# EAGLE design ArduSensor Shield-v13 (EAGLE 6.5.0)
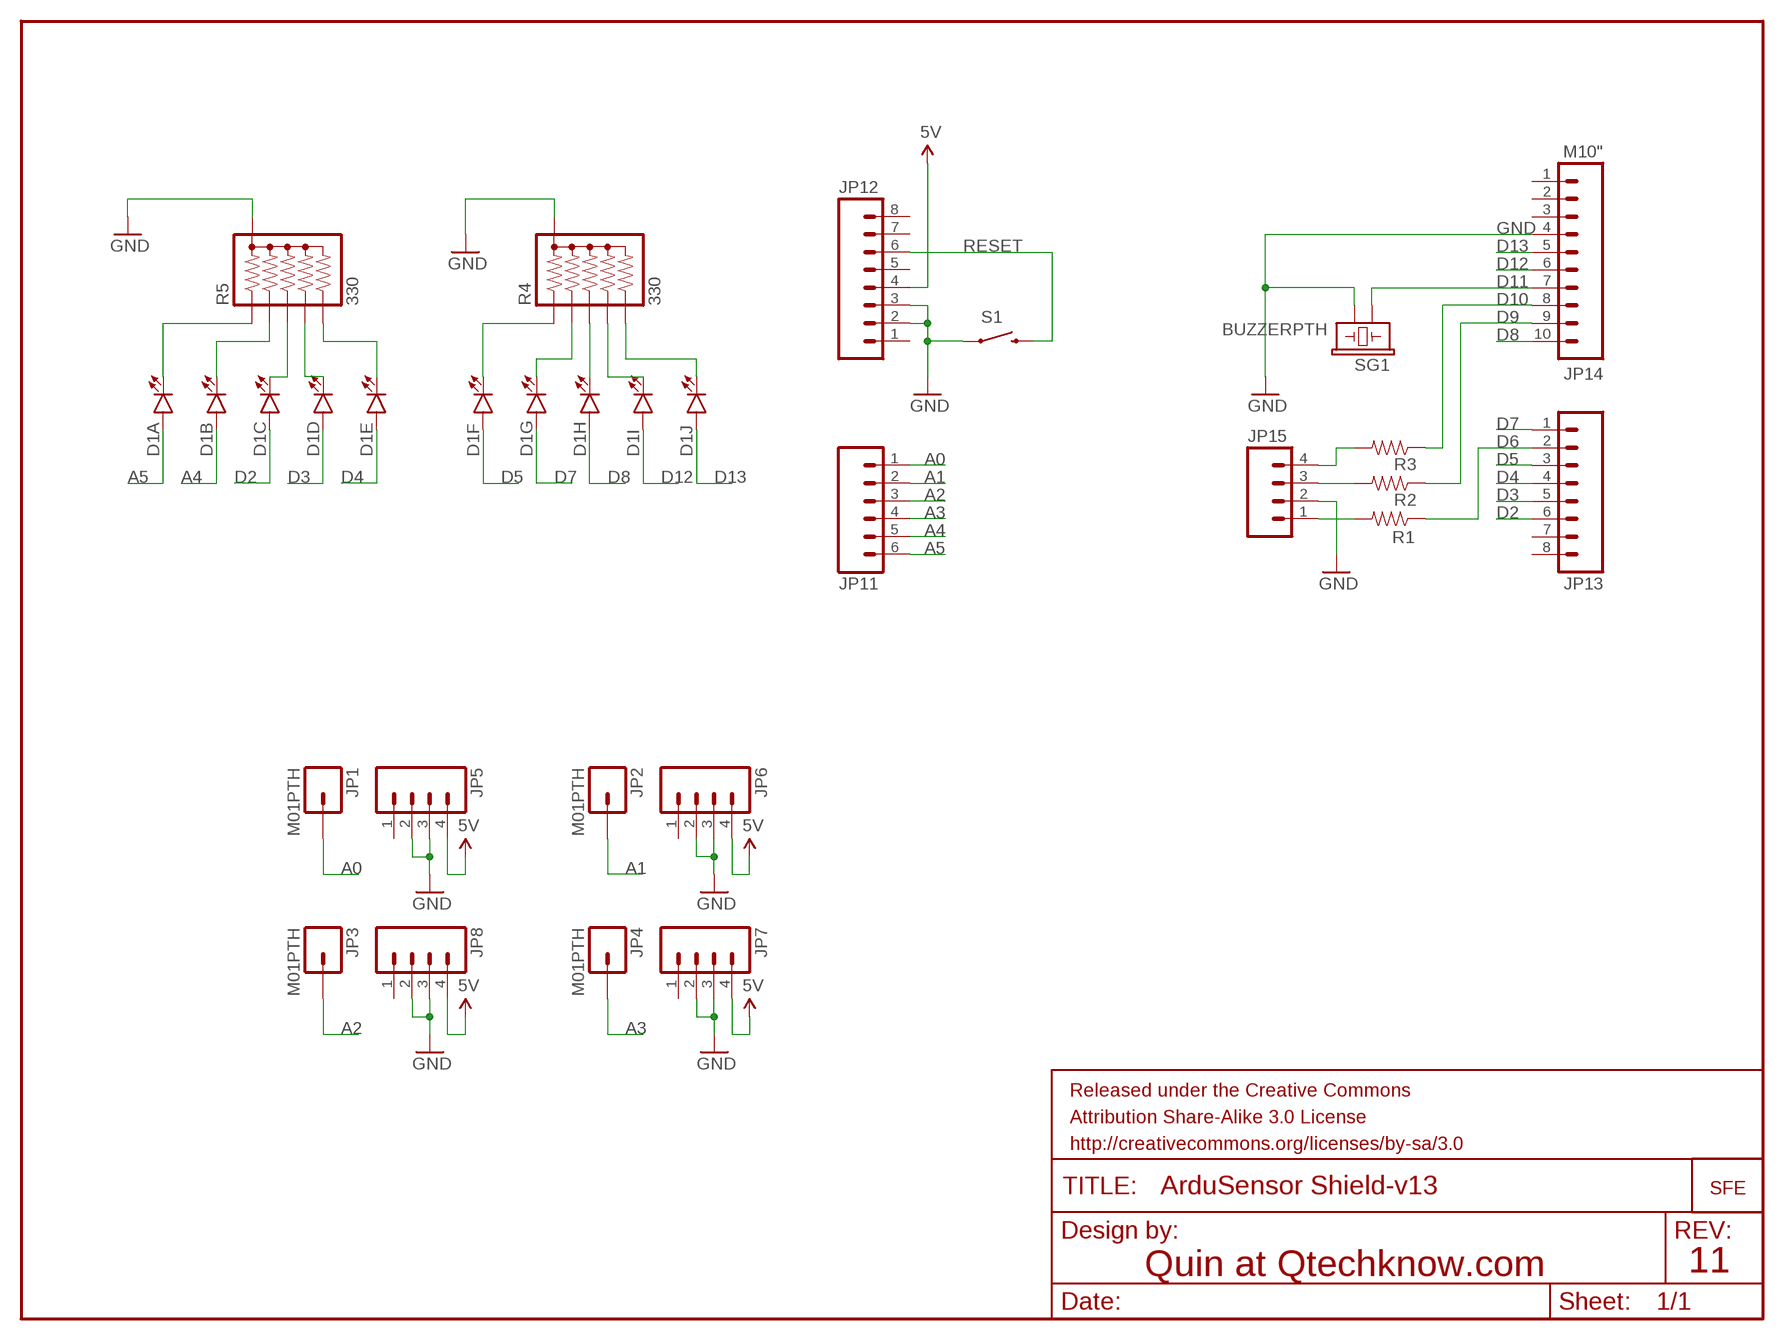
[diagram p0: schematic, sheet 1]

## Parts
D1  LED_BARGRAPH_10  [LED_BARGAPH_10]
FRAME1  FRAME-LETTER  [CREATIVE_COMMONS]
JP1  M01PTH  [1X01]
JP2  M01PTH  [1X01]
JP3  M01PTH  [1X01]
JP4  M01PTH  [1X01]
JP5  M04PTH  [1X04]
JP6  M04PTH  [1X04]
JP7  M04PTH  [1X04]
JP8  M04PTH  [1X04]
JP9  LOGO-SFENEW  [SFE-NEW-WEBLOGO]
JP11  M06SIP  [1X06]
JP12  M081X08  [1X08]
JP13  M081X08  [1X08]
JP14  M10"  [1X10]
JP15  M04PTH  [1X04]
R1  RESISTORPTH-1/6W  [1/6W-RES]
R2  RESISTORPTH-1/6W  [1/6W-RES]
R3  RESISTORPTH-1/6W  [1/6W-RES]
R4  330  RPACK-BUSSED-SIP-PTH-5  [RPACK-SIP-PTH-5]
R5  330  RPACK-BUSSED-SIP-PTH-5  [RPACK-SIP-PTH-5]
S1  SWITCH-MOMENTARY-2PTH  [TACTILE-PTH]
SG1  BUZZERPTH  [BUZZER-12MM]

## Nets
5V: JP5.4 JP6.4 JP7.4 JP8.4 JP12.4
A0: JP1.1 JP11.1
A1: JP2.1 JP11.2
A2: JP3.1 JP11.3
A3: JP4.1 JP11.4
A4: D1.2(B:A) JP11.5
A5: D1.1(A:A) JP11.6
D2: D1.3(C:A) JP13.6
D3: D1.4(D:A) JP13.5
D4: D1.5(E:A) JP13.4
D5: D1.6(F:A) JP13.3
D6: JP13.2 R1.1
D7: D1.7(G:A) JP13.1
D8: D1.8(H:A) JP14.10
D9: JP14.9 R2.1
D10: JP14.8 R3.1
D11: JP14.7 SG1.+
D12: D1.9(I:A) JP14.6
D13: D1.10(J:A) JP14.5
GND: JP5.2 JP5.3 JP6.2 JP6.3 JP7.2 JP7.3 JP8.2 JP8.3 JP12.2 JP12.3 JP14.4 JP15.2 R4.P$1 R5.P$1 S1.1 SG1.-
N$1: JP15.1 R1.2
N$2: JP15.3 R2.2
N$3: JP15.4 R3.2
N$17: D1.11(J:C) R4.P$6
N$18: D1.12(I:C) R4.P$5
N$19: D1.13(H:C) R4.P$4
N$20: D1.14(G:C) R4.P$3
N$21: D1.15(F:C) R4.P$2
N$23: D1.16(E:C) R5.P$6
N$24: D1.17(D:C) R5.P$5
N$25: D1.18(C:C) R5.P$4
N$26: D1.19(B:C) R5.P$3
N$27: D1.20(A:C) R5.P$2
RESET: JP12.6 S1.3
Unconnected: JP5.1 JP6.1 JP7.1 JP8.1 JP12.1 JP12.5 JP12.7 JP12.8 JP13.7 JP13.8 JP14.1 JP14.2 JP14.3

## Notes on the sheet
- Quin at Qtechknow.com | 11

## Library data of the parts
D1 = SFE LED:LED_BARGRAPH_10: 10-Segment LED Bar Graph SFE part numbers: COM-09935 (red, Vf = 2.1V, Ifmax = 20mA) COM-09936 (yellow, Vf = 2.1V, Ifmax = 20mA) COM-09937 (blue, Vf = 3.4V, Ifmax = 20mA) COM-09938 (green, Vf = 3.4V, Ifmax = 20mA)
FRAME1 = SparkFun-Aesthetics:FRAME-LETTER: Schematic Frame Standard 8.5x11 US Letter frame
JP1-JP4 = SFE Connectors:M01: Header 1 Standard 1-pin 0.1" header. Use with straight break away headers (SKU : PRT-00116), right angle break away headers (PRT-00553), swiss pins (PRT-00743), machine pins (PRT-00117), and female headers (PRT-00115).
JP5-JP8 JP15 = SFE Connectors:M04: Header 4 Standard 4-pin 0.1" header. Use with straight break away headers (SKU : PRT-00116), right angle break away headers (PRT-00553), swiss pins (PRT-00743), machine pins (PRT-00117), and female headers (PRT-00115). Molex polarized connector foot print use with SKU : PRT-08231 with associated crimp pins and housings. 1MM SMD Version SKU: PRT-10208
JP9 = SparkFun-Aesthetics:LOGO-SFE: Spark Fun Electronics PCB Logo This is the standard Spark Fun Electronics PCB logo.
JP11 = SFE Connectors:M06: Header 6 Standard 6-pin 0.1" header. Use with straight break away headers (SKU : PRT-00116), right angle break away headers (PRT-00553), swiss pins (PRT-00743), machine pins (PRT-00117), and female headers (PRT-00115). Molex polarized connector foot print use with SKU : PRT-08094 with associated crimp pins and housings. NOTES ON THE VARIANTS LOCK and LOCK_LONGPADS... This footprint was designed to help hold the alignment of a through-hole component (i.e. 6-pin header) while soldering it into place. You may notice that each hole has been shifted either up or down by 0.005 of an inch from it's more standard position (which is a perfectly straight line). This slight alteration caused the pins (the squares in the middle) to touch the edges of the holes. Because they are alternating, it causes a "brace" to hold the component in place. 0.005 has proven to be the perfect amount of "off-center" position when using our standard breakaway headers. Although looks a little odd when you look at the bare footprint, once you have a header in there, the alteration is very hard to notice. Also, if you push a header all the way into place, it is covered up entirely on the bottom side. This idea of altering the position of holes to aid alignment will be further integrated into the Sparkfun Library for other footprints. It can help hold any component with 3 or more connection pins.
JP12 JP13 = SFE Connectors:M08: Header 8 Standard 8-pin 0.1" header. Use with straight break away headers (SKU : PRT-00116), right angle break away headers (PRT-00553), swiss pins (PRT-00743), machine pins (PRT-00117), and female headers (PRT-00115).
JP14 = SFE Connectors:M10: Header 10 Standard 10-pin 0.1" header. Use with straight break away headers (SKU : PRT-00116), right angle break away headers (PRT-00553), swiss pins (PRT-00743), machine pins (PRT-00117), and female headers (PRT-00115).
R1-R3 = SparkFun-Resistors:RESISTOR: Resistor Basic schematic elements and footprints for 0603, 1206, and PTH resistors.
R4 R5 = SparkFun-Resistors:RPACK: BOURNS 4600X series thick-film SIP resistor packs Five resistors bussed to a single pin (denoted by dot). 0.2W / resistor datasheet <http://dlnmh9ip6v2uc.cloudfront.net/datasheets/Components/General/4600x.pdf> SFE parts COM-10855 (330), COM-10856 (10K)
S1 = SFE Electromechanical:SWITCH-MOMENTARY-2: Various NO switches- pushbuttons, reed, etc
SG1 = SFE Electromechanical:BUZZER: Buzzer 12mm Spark Fun Electronics SKU : Comp-Buzzer

## Board
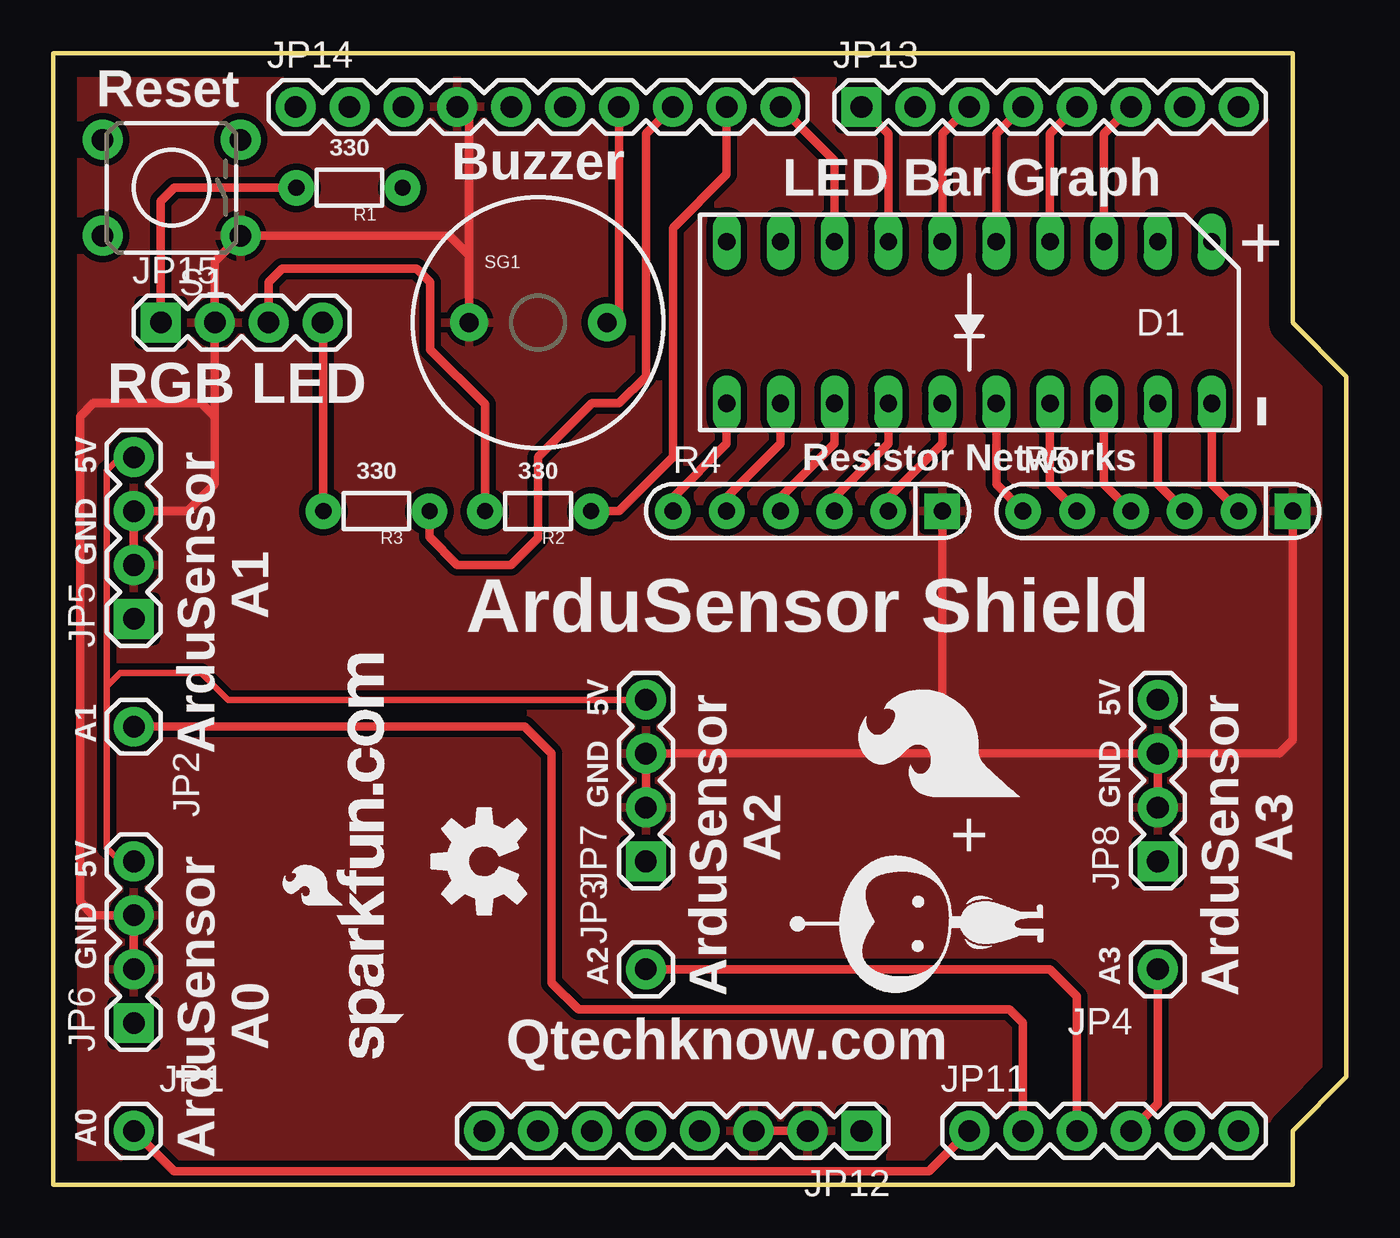
[diagram p1: board, top side]
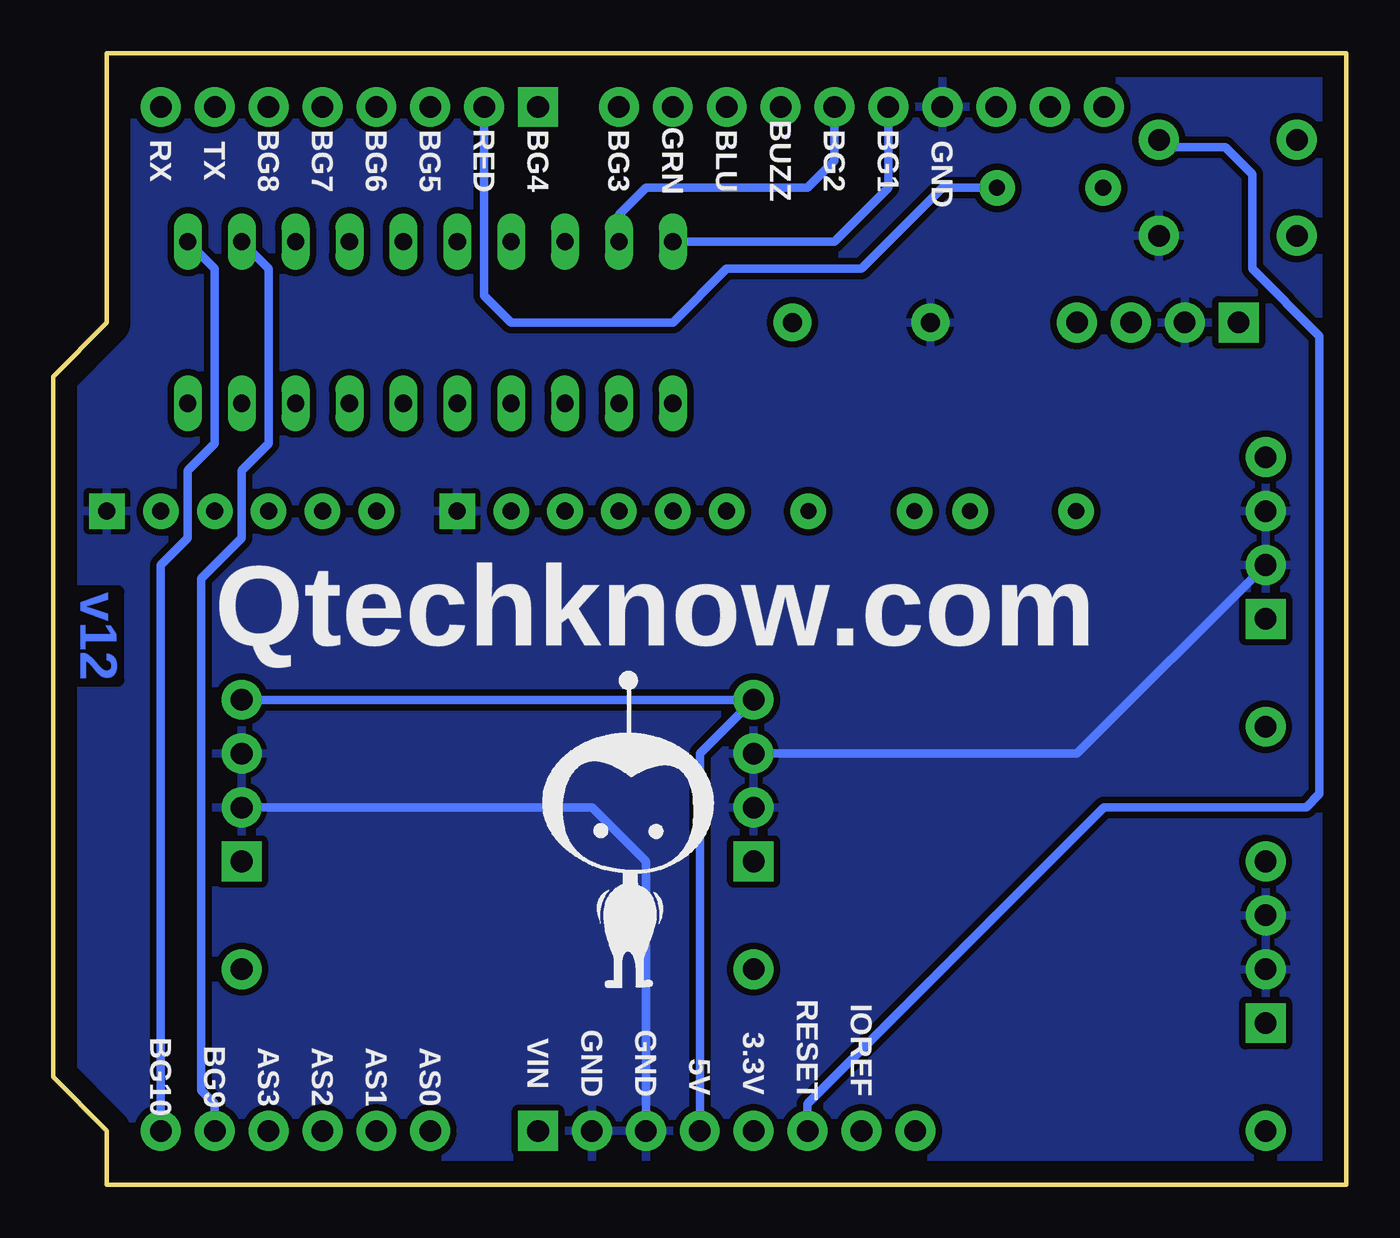
[diagram p2: board, bottom side, seen from below]

Size 60.96 x 53.34 mm. Coordinates in mm from the lower left corner, seen from the top.
Outline: 0,0 58.42,0 58.42,2.54 60.96,5.08 60.96,38.1 58.42,40.64 58.42,53.34 0,53.33 0,0
Copper layers (1*16): Top 0.035mm / dielectric 1.5mm / Bottom 0.035mm
Design rules "default": minimum track width 10mil, minimum drill 24mil, track to track 8mil, track to pad 8mil, pad to pad 8mil, via to via 8mil, smd to smd 8mil, copper to edge 40mil, drill to drill 8mil, minimum pad ring 10mil, minimum via ring 8mil, stop-mask expansion 4mil, vias tented up to drill 0mil, thermal gap 10mil

### Footprints (pad centres in the part's own frame; a part is rotated, then mirrored left to right if it is on the bottom)
LED_BARGAPH_10 = drill 0.813 long: 1 -11.43,-3.81; 2 -8.89,-3.81; 3 -6.35,-3.81; 4 -3.81,-3.81; 5 -1.27,-3.81; 6 1.27,-3.81; 7 3.81,-3.81; 8 6.35,-3.81; 9 8.89,-3.81; 10 11.43,-3.81; 11 11.43,3.81; 12 8.89,3.81; 13 6.35,3.81; 14 3.81,3.81; 15 1.27,3.81; 16 -1.27,3.81; 17 -3.81,3.81; 18 -6.35,3.81; 19 -8.89,3.81; 20 -11.43,3.81
1X01 = drill 1.016 pad 1.88: 1 0,0
1X04 = drill 1.016 pad 1.88 square: 1 0,0 | drill 1.016 pad 1.88: 2 2.54,0; 3 5.08,0; 4 7.62,0
1X06 = drill 1.016 pad 1.88: 1 0,0; 2 2.54,0; 3 5.08,0; 4 7.62,0; 5 10.16,0; 6 12.7,0
1X08 = drill 1.016 pad 1.88 square: 1 0,0 | drill 1.016 pad 1.88: 2 2.54,0; 3 5.08,0; 4 7.62,0; 5 10.16,0; 6 12.7,0; 7 15.24,0; 8 17.78,0
1X10 = drill 1.016 pad 1.88: 1 0,0; 2 2.54,0; 3 5.08,0; 4 7.62,0; 5 10.16,0; 6 12.7,0; 7 15.24,0; 8 17.78,0; 9 20.32,0; 10 22.86,0
1/6W-RES = drill 0.762 pad 1.676: 1 -2.5,0; 2 2.5,0
RPACK-SIP-PTH-5 = drill 0.8 pad 1.676 square: P$1 0,0 | drill 0.8 pad 1.676: P$2 0,-2.54; P$3 0,-5.08; P$4 0,-7.62; P$5 0,-10.16; P$6 0,-12.7
TACTILE-PTH = drill 1.016 pad 1.88: 1 -3.251,2.261; 2 3.251,2.261; 3 -3.251,-2.261; 4 3.251,-2.261
BUZZER-12MM = drill 0.9 pad 1.778: + 3.25,0; - -3.25,0

### Placement (x,y rotation side)
D1  43.18,40.64 180 top
FRAME1  19.05,-19.05 0 top  (outside the outline)
JP1  3.81,2.54 0 top
JP2  3.81,21.59 270 top
JP3  27.94,10.16 90 top
JP4  52.07,10.16 180 top
JP5  3.81,26.67 90 top
JP6  3.81,7.62 90 top
JP7  27.94,15.24 90 top
JP8  52.07,15.24 90 top
JP9  16.51,5.97 90 top
JP11  43.18,2.54 0 top
JP12  38.1,2.54 180 top
JP13  38.1,50.8 0 top
JP14  11.43,50.8 0 top
JP15  5.08,40.64 0 top
R1  13.97,46.99 180 top
R2  22.86,31.75 180 top
R3  15.24,31.75 180 top
R4  41.91,31.75 270 top
R5  58.42,31.75 270 top
S1  5.59,46.99 180 top
SG1  22.86,40.64 0 top
U$6  [SFE_LOGO_FLAME_.3]  45.72,17.78 90 top
U$7  [QTK_GUYBIG]  34.29,15.24 0 bottom
U$8  [OSHW-LOGO-M]  20.32,15.24 90 top
U$10  [QTK_GUYMEDIUM]  41.91,12.7 90 top

### Tracks (layer width: path | path; a pad name or v marks a point on that pad's centre or on a via)
5V
  Top 0.305: JP5.4 3.17,34.29 2.54,33.66 2.54,23.5 | 2.54,23.5 2.54,15.88 3.17,15.24 JP6.4 | JP7.4 8.26,22.86 6.99,24.13 3.17,24.13 2.54,23.5
  Bottom 0.406: JP8.4 JP7.4 30.48,20.32 JP12.4
A0
  Top 0.406: JP11.1 41.27,0.64 5.71,0.64 JP1.1
A1
  Top 0.406: JP11.2 45.72,7.62 45.09,8.26 24.77,8.26 23.5,9.53 23.5,20.32 22.23,21.59 JP2.1
A2
  Top 0.406: JP11.3 48.26,8.89 46.99,10.16 JP3.1
A3
  Top 0.406: JP4.1 52.07,3.81 JP11.4
A4
  Bottom 0.406: JP11.5 53.34,3.81 53.98,4.45 53.98,28.57 52.07,30.48 52.07,33.66 50.8,34.92 50.8,43.18 D1.2
A5
  Bottom 0.406: D1.1 53.34,43.18 53.34,34.92 54.61,33.66 54.61,30.48 55.88,29.21 JP11.6
D2
  Top 0.406: D1.3 49.53,49.53 JP13.6
D3
  Top 0.406: D1.4 46.99,49.53 JP13.5
D4
  Top 0.406: D1.5 44.45,49.53 JP13.4
D5
  Top 0.406: D1.6 41.91,49.53 JP13.3
D6
  Bottom 0.406: R1.1 19.05,46.99 22.86,43.18 29.21,43.18 31.75,40.64 39.37,40.64 40.64,41.91 JP13.2
D7
  Top 0.406: D1.7 39.37,49.53 JP13.1
D8
  Top 0.406: D1.8 36.83,48.26 JP14.10
D9
  Top 0.406: R2.1 26.67,31.75 29.21,34.29 29.21,45.09 31.75,47.62 JP14.9
D10
  Top 0.406: R3.1 17.74,30.52 19.05,29.21 21.59,29.21 22.86,30.48 22.86,34.29 25.4,36.83 26.67,36.83 27.94,38.1 27.94,49.53 JP14.8
D11
  Top 0.406: JP14.7 26.67,41.2 SG1.+
D12
  Bottom 0.406: D1.9 34.29,45.72 33.02,46.99 25.4,46.99 24.13,48.26 JP14.6
D13
  Bottom 0.406: D1.10 24.13,44.45 21.59,46.99 JP14.5
GND
  Top 0.406: SG1.- 19.61,43.81 | 19.61,43.81 19.61,50.24 JP14.4 | 19.61,43.81 18.7,44.73 S1.1 7.62,43.51 JP15.2 7.62,36.2 | R5.P$1 58.42,20.95 57.78,20.32 JP8.3 | JP8.2 JP8.3 | R4.P$1 41.91,20.95 | 41.91,20.95 42.55,20.32 JP8.3 | 41.91,20.95 41.27,20.32 JP7.3 JP7.2 | JP6.2 JP6.3 1.91,12.7 1.27,13.34 1.27,36.2 1.91,36.83 6.99,36.83 7.62,36.2 | JP5.2 JP5.3 6.35,31.75 7.62,33.02 7.62,36.2 | JP12.3 JP12.2
  Bottom 0.406: JP12.3 33.02,15.24 35.56,17.78 JP8.2 | JP7.3 12.7,20.32 JP5.2
  pour Top (isolate 0.305): 0,53.34 58.42,53.34 58.42,40.64 60.96,38.1 60.96,5.08 58.42,2.54 58.42,0 0,0
  pour Bottom (isolate 0.305): 0,53.34 58.42,53.34 58.42,40.64 60.96,38.1 60.96,5.08 58.42,2.54 58.42,0 0,0
N$1
  Top 0.406: JP15.1 5.08,46.35 5.71,46.99 R1.2
N$2
  Top 0.406: R2.2 20.36,36.79 17.78,39.37 17.78,42.55 17.14,43.18 10.79,43.18 10.16,42.55 JP15.3
N$3
  Top 0.406: R3.2 12.74,40.6 JP15.4
N$17
  Top 0.406: D1.11 31.75,34.92 29.21,32.38 R4.P$6
N$18
  Top 0.406: D1.12 34.29,34.92 31.75,32.38 R4.P$5
N$19
  Top 0.406: R4.P$4 34.29,32.38 36.83,34.92 D1.13
N$20
  Top 0.406: R4.P$3 36.83,32.38 39.37,34.92 D1.14
N$21
  Top 0.406: R4.P$2 39.37,32.38 41.91,34.92 D1.15
N$23
  Top 0.406: D1.16 44.45,33.02 R5.P$6
N$24
  Top 0.406: D1.17 46.99,33.02 R5.P$5
N$25
  Top 0.406: D1.18 49.53,33.02 R5.P$4
N$26
  Top 0.406: D1.19 52.07,33.02 R5.P$3
N$27
  Top 0.406: D1.20 54.61,33.02 R5.P$2
RESET
  Bottom 0.406: S1.3 8.48,48.9 5.71,48.9 4.45,47.62 4.45,43.18 1.27,40.01 1.27,18.41 1.91,17.78 11.43,17.78 25.4,3.81 JP12.6

### Text on the board
Bottom: v12
tPlace: Reset | 330 | Buzzer | LED Bar Graph | + | RGB LED | - | 5V | 330 | 330 | Resistor Networks | GND | A1 | ArduSensor Shield | 5V | 5V | A1 | ArduSensor | GND | GND | + | A2 | A3 | 5V | GND | A2 | ArduSensor | A3 | ArduSensor | Qtechknow.com | A0 | A0 | ArduSensor
bPlace: GND | BG1 | BG2 | BUZZ | BLU | GRN | BG3 | BG4 | RED | BG5 | BG6 | BG7 | BG8 | TX | RX | Qtechknow.com | IOREF | RESET | 3.3V | GND | GND | VIN | 5V | AS0 | AS1 | AS2 | AS3 | BG9 | BG10
tValues: Quin at Qtechknow